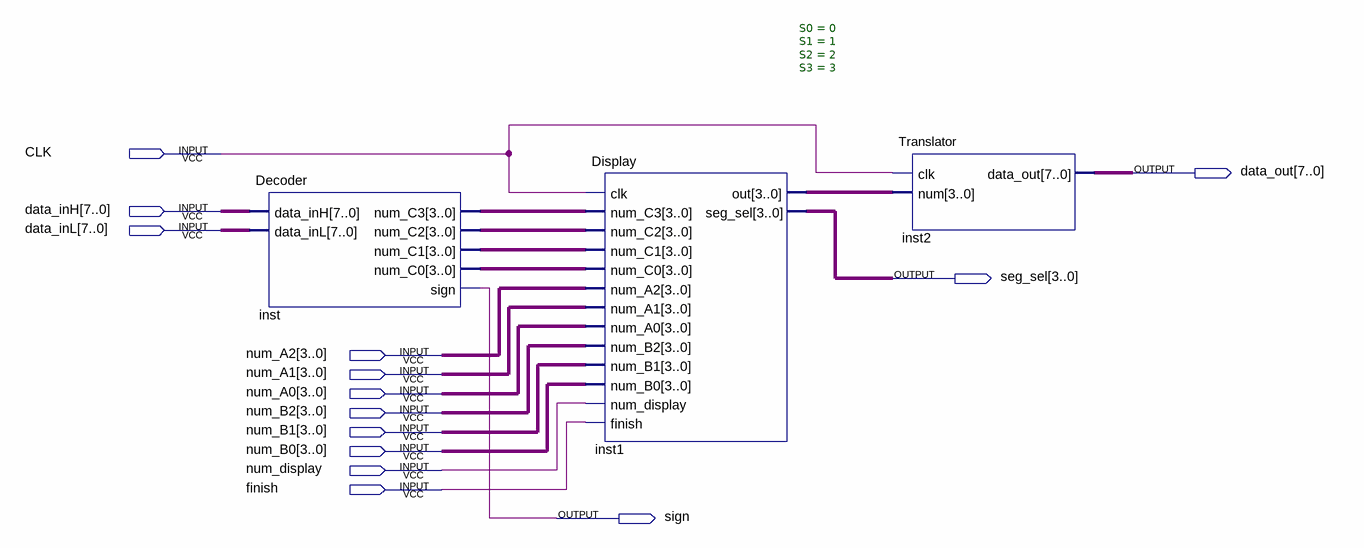
[diagram p0: schematic sheet]
// Quartus schematic seg.bdf as structural Verilog: 3 symbols, 14 pins
module seg (
  input  CLK,
  input  [7:0] data_inH,
  input  [7:0] data_inL,
  input  [3:0] num_A2,
  input  [3:0] num_A1,
  input  [3:0] num_A0,
  input  [3:0] num_B2,
  input  [3:0] num_B1,
  input  [3:0] num_B0,
  input  num_display,
  input  finish,
  output [7:0] data_out,
  output [3:0] seg_sel,
  output sign
);

  wire [3:0] inst1_out, inst_num_c0, inst_num_c1, inst_num_c2, inst_num_c3;

  Decoder inst (
    .data_inH(data_inH), .data_inL(data_inL), .num_C3(inst_num_c3), .num_C2(inst_num_c2),
    .num_C1(inst_num_c1), .num_C0(inst_num_c0), .sign(sign));
  Display #(.S0(0), .S1(1), .S2(2), .S3(3)) inst1 (
    .clk(CLK), .num_C3(inst_num_c3), .num_C2(inst_num_c2), .num_C1(inst_num_c1), .num_C0(inst_num_c0),
    .num_A2(num_A2), .num_A1(num_A1), .num_A0(num_A0), .num_B2(num_B2), .num_B1(num_B1), .num_B0(num_B0),
    .num_display(num_display), .finish(finish), .out(inst1_out), .seg_sel(seg_sel));
  Translator inst2 (.clk(CLK), .num(inst1_out), .data_out(data_out));
endmodule
